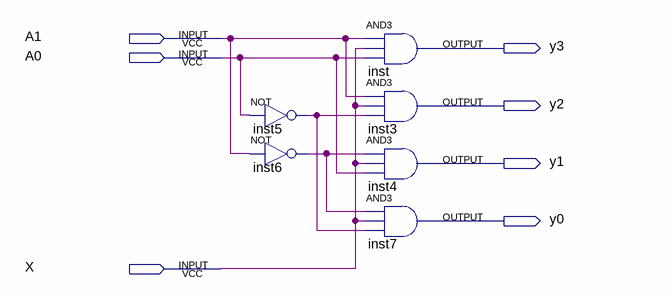
[diagram p0: schematic sheet]
// Quartus schematic DMX2-4.bdf as structural Verilog: 6 symbols, 7 pins
module \DMX2-4  (
  input  A1,
  input  A0,
  input  X,
  output y3,
  output y2,
  output y1,
  output y0
);

  wire inst5_out, inst6_out;

  not inst5 (inst5_out, A0);
  not inst6 (inst6_out, A1);
  and inst (y3, A1, X, A0);
  and inst3 (y2, A1, X, inst5_out);
  and inst4 (y1, inst6_out, X, A0);
  and inst7 (y0, inst6_out, X, inst5_out);
endmodule
